# Altium schematic sheet PcbBox_Demonstateur.SchDoc
size A4; Organization: Altium Limited; Address1: Laboratoire de Systèmes Embarqués; Address2: 7, rue de la Serre; Address3: 2610 Saint-Imier / Switzerland
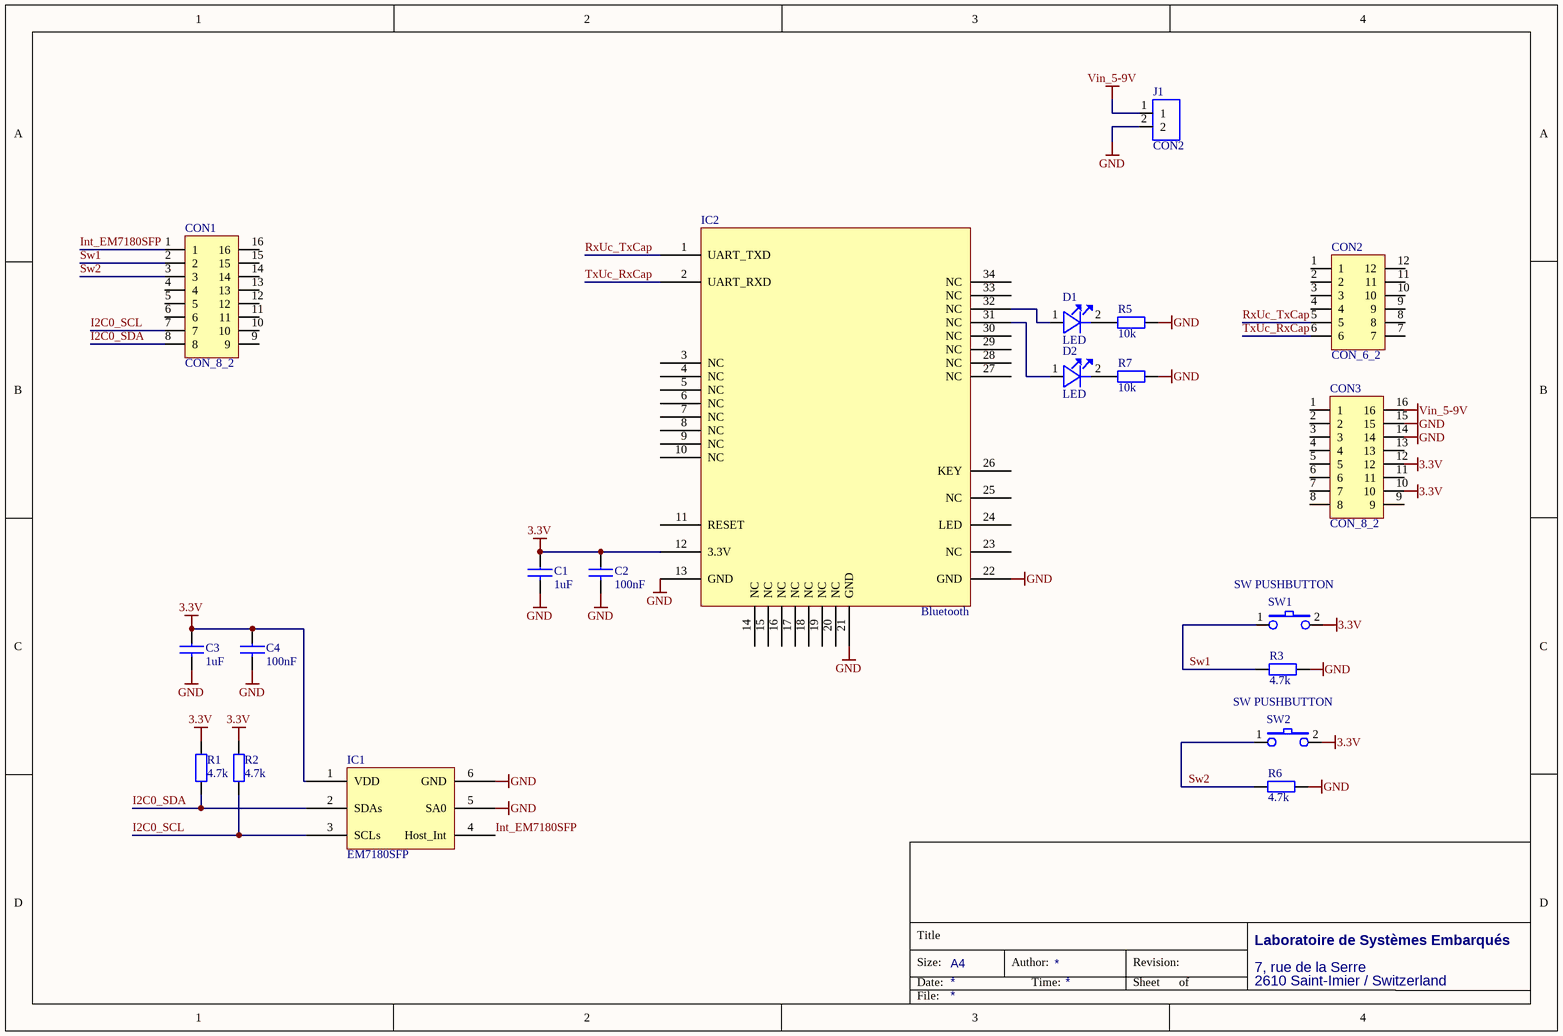
[diagram p0: PcbBox_Demonstateur.SchDoc]

## Parts
C1  1uF  [080503]
C2  100nF  [080503]
C3  1uF  [080503]
C4  100nF  [080503]
CON1  CON_8_2  [J208]
CON2  CON_6_2  [j206]
CON3  CON_8_2  [J208]
D1  LED  [0805_Led]
D2  LED  [0805_Led]
IC1  EM7180SFP  [Footprint_EM7180]
IC2  Bluetooth  [BT HC-05]
J1  CON2  [J201]
R1  value 4.7k  [080501]  (hidden comment: RES)
R2  value 4.7k  [080501]  (hidden comment: RES)
R3  value 4.7k  [080501]  (hidden comment: RES)
R5  value 10k  [080501]  (hidden comment: RES)
R6  value 4.7k  [080501]  (hidden comment: RES)
R7  value 10k  [080501]  (hidden comment: RES)
SW1  SW PUSHBUTTON  [BoutonPoussoir]
SW2  SW PUSHBUTTON  [BoutonPoussoir]

## Nets
3.3V: C1.1 C2.1 C3.1 C4.1 CON3.10 CON3.12 IC1.1(VDD) IC2.12(3.3V) R1.1 R2.1 SW1.2 SW2.2
GND: C1.2 C2.2 C3.2 C4.2 CON3.14 CON3.15 IC1.5(SA0) IC1.6(GND) IC2.13(GND) IC2.21(GND) IC2.22(GND) J1.2 R3.2 R5.2 R6.2 R7.2
Vin_5-9V: CON3.16 J1.1
I2C0_SCL: CON1.7 IC1.3(SCLs) R2.2
I2C0_SDA: CON1.8 IC1.2(SDAs) R1.2
Int_EM7180SFP: CON1.1 IC1.4(Host_Int)
RxUc_TxCap: CON2.5 IC2.1(UART_TXD)
Sw1: CON1.2 R3.1 SW1.1
Sw2: CON1.3 R6.1 SW2.1
TxUc_RxCap: CON2.6 IC2.2(UART_RXD)
NetD1_1: D1.1(AN) IC2.32(NC)
NetD1_2: D1.2(CAT) R5.1
NetD2_1: D2.1(AN) IC2.31(NC)
NetD2_2: D2.2(CAT) R7.1

Not connected (* = marked no-connect by the designer): CON1 4 5 6 9 10 11 12 13 14 15 16; CON2 1 2 3 4 7 8 9 10 11 12; CON3 1 2 3 4 5 6 7 8 9 11 13; IC2 3(NC) 4(NC) 5(NC) 6(NC) 7(NC) 8(NC) 9(NC) 10(NC) 11(RESET) 14(NC) 15(NC) 16(NC) 17(NC) 18(NC) 19(NC) 20(NC) 23(NC) 24(LED) 25(NC) 26(KEY) 27(NC) 28(NC) 29(NC) 30(NC) 33(NC) 34(NC)

## Notes on the sheet
- Title
- Size:
- Date:
- A4
- Author:
- Time:
- Revision:
- Sheet
- of
- File:

## Library data of the parts
C1-C4 = CAPA: Condo céramique; Right: 20; Bottom: 10
  C1 C3: Value: 1uF
  C2 C4: Value: 100nF
D1 D2 = LED: Right: 40; Bottom: 20
IC2 = SEEDSTUDIO_HC-05
J1 = CON2: Right: 20; Bottom: 50
R1-R3 R5-R7 = RES: Resistance; Class I: Passive; Class II: Resistor; Revision: July-2002: Re-released for DXP Platform.